# EAGLE design led_analog_watch_mvmt_v1_1 (EAGLE 5.11)
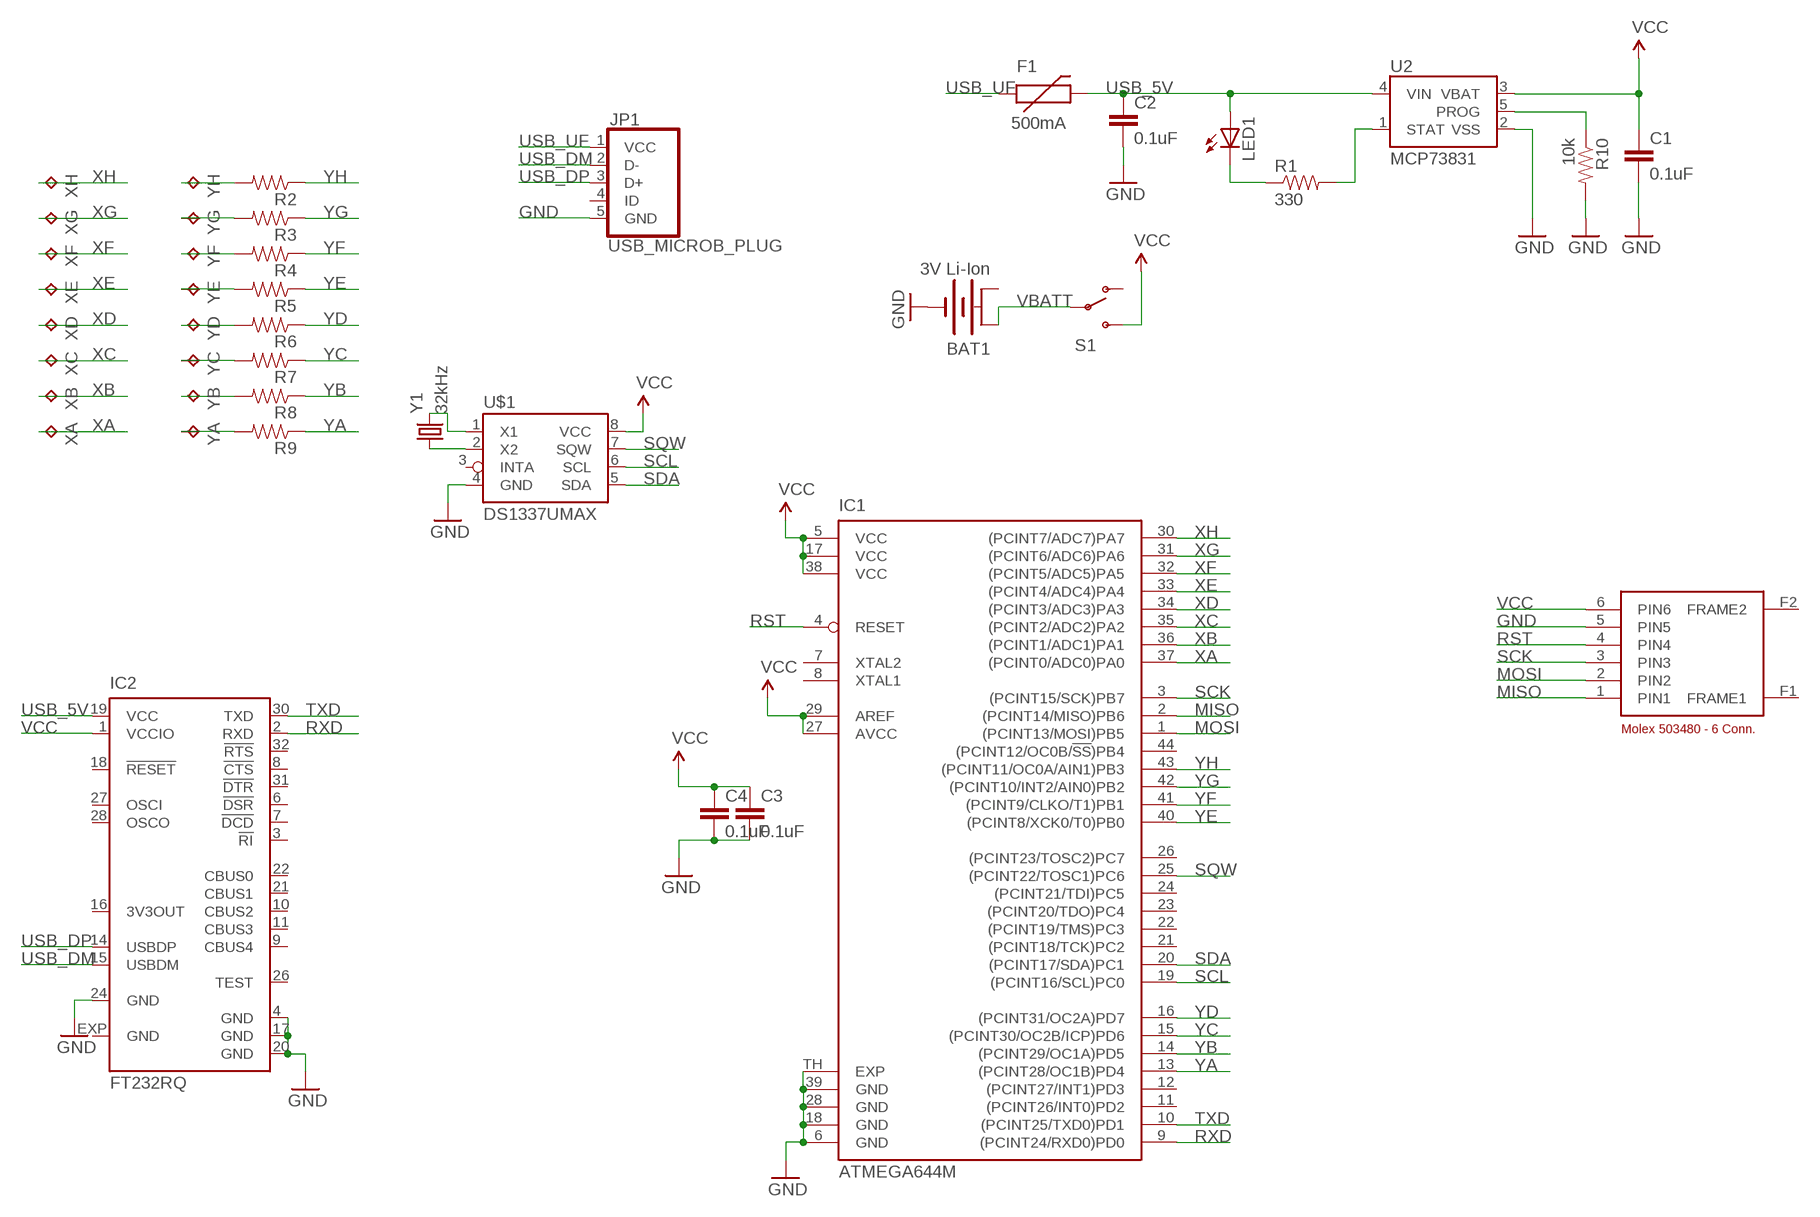
[diagram p0: schematic, sheet 1]

## Parts
BAT1  3V Li-Ion  BATTERY245PTH  [BATTCON_245MM_PTH]
C1  0.1uF  CAP-0603  [0603-CAP]
C2  0.1uF  CAP-0603  [0603-CAP]
C3  0.1uF  CAP-0603  [0603-CAP]
C4  0.1uF  CAP-0603  [0603-CAP]
F1  500mA  PTC0603  [0603]
IC1  ATMEGA644M  [MLF44-TH]
IC2  FT232RQ  [QFN32]
JP1  USB_MICROB_PLUG  [USB_MICRO_B_TYCO]
LED1  LED-0402  [0402]
R1  330  RESISTOR-0603  [0603]
R2  RESISTOR-0603  [0603]
R3  RESISTOR-0603  [0603]
R4  RESISTOR-0603  [0603]
R5  RESISTOR-0603  [0603]
R6  RESISTOR-0603  [0603]
R7  RESISTOR-0603  [0603]
R8  RESISTOR-0603  [0603]
R9  RESISTOR-0603  [0603]
R10  10k  RESISTOR-0603  [0603]
S1  SWITCH-SPSTMA12R  [SWITCH-MA12R]
U2  MCP73831  [SOT23-5]
U$1  DS1337UMAX  [UMAX8]
U$2  MOLEX_503480  [MOLEX_503480]
XA  TPTP20R  [TP20R]
XB  TPTP20R  [TP20R]
XC  TPTP20R  [TP20R]
XD  TPTP20R  [TP20R]
XE  TPTP20R  [TP20R]
XF  TPTP20R  [TP20R]
XG  TPTP20R  [TP20R]
XH  TPTP20R  [TP20R]
Y1  32kHz  CRYSTALABS10  [CRYSTAL-ABS10-SMD]
YA  TPTP20R  [TP20R]
YB  TPTP20R  [TP20R]
YC  TPTP20R  [TP20R]
YD  TPTP20R  [TP20R]
YE  TPTP20R  [TP20R]
YF  TPTP20R  [TP20R]
YG  TPTP20R  [TP20R]
YH  TPTP20R  [TP20R]

## Nets
GND: BAT1.2(-) C1.2 C2.2 C3.2 C4.2 IC1.6(GND) IC1.18(GND) IC1.28(GND) IC1.39(GND) IC1.TH(EXP) IC2.4(GND) IC2.17(GND) IC2.20(GND) IC2.24(GND) JP1.5(GND) R10.2 U2.2(VSS) U$1.4(GND) U$2.5(PIN5)
MISO: IC1.2((PCINT14/MISO)PB6) U$2.1(PIN1)
MOSI: IC1.1((PCINT13/MOSI)PB5) U$2.2(PIN2)
N$1: R1.2 U2.1(STAT)
N$2: R10.1 U2.5(PROG)
N$3: R2.2 YH.TP
N$4: R3.2 YG.TP
N$5: R4.2 YF.TP
N$6: R5.2 YE.TP
N$7: R6.2 YD.TP
N$8: R7.2 YC.TP
N$9: R8.2 YB.TP
N$10: R9.2 YA.TP
N$11: LED1.2(C) R1.1
N$14: U$1.2(X2) Y1.X1
N$15: U$1.1(X1) Y1.X2
RST: IC1.4(RESET) U$2.4(PIN4)
RXD: IC1.9((PCINT24/RXD0)PD0) IC2.2(RXD)
SCK: IC1.3((PCINT15/SCK)PB7) U$2.3(PIN3)
SCL: IC1.19((PCINT16/SCL)PC0) U$1.6(SCL)
SDA: IC1.20((PCINT17/SDA)PC1) U$1.5(SDA)
SQW: IC1.25((PCINT22/TOSC1)PC6) U$1.7(SQW)
TXD: IC1.10((PCINT25/TXD0)PD1) IC2.30(TXD)
USB_5V: C2.1 F1.2 IC2.19(VCC) LED1.1(A) U2.4(VIN)
USB_DM: IC2.15(USBDM) JP1.2(D-)
USB_DP: IC2.14(USBDP) JP1.3(D+)
USB_UF: F1.1 JP1.1(VCC)
VBATT [supply]: BAT1.3(+A) S1.2(P)
VCC: C1.1 C3.1 C4.1 IC1.5(VCC) IC1.17(VCC) IC1.27(AVCC) IC1.29(AREF) IC1.38(VCC) IC2.1(VCCIO) S1.3(S) U2.3(VBAT) U$1.8(VCC) U$2.6(PIN6)
XA: IC1.37((PCINT0/ADC0)PA0) XA.TP
XB: IC1.36((PCINT1/ADC1)PA1) XB.TP
XC: IC1.35((PCINT2/ADC2)PA2) XC.TP
XD: IC1.34((PCINT3/ADC3)PA3) XD.TP
XE: IC1.33((PCINT4/ADC4)PA4) XE.TP
XF: IC1.32((PCINT5/ADC5)PA5) XF.TP
XG: IC1.31((PCINT6/ADC6)PA6) XG.TP
XH: IC1.30((PCINT7/ADC7)PA7) XH.TP
YA: IC1.13((PCINT28/OC1B)PD4) R9.1
YB: IC1.14((PCINT29/OC1A)PD5) R8.1
YC: IC1.15((PCINT30/OC2B/ICP)PD6) R7.1
YD: IC1.16((PCINT31/OC2A)PD7) R6.1
YE: IC1.40((PCINT8/XCK0/T0)PB0) R5.1
YF: IC1.41((PCINT9/CLKO/T1)PB1) R4.1
YG: IC1.42((PCINT10/INT2/AIN0)PB2) R3.1
YH: IC1.43((PCINT11/OC0A/AIN1)PB3) R2.1
Unconnected: IC1.7(XTAL2) IC1.8(XTAL1) IC1.11((PCINT26/INT0)PD2) IC1.12((PCINT27/INT1)PD3) IC1.21((PCINT18/TCK)PC2) IC1.22((PCINT19/TMS)PC3) IC1.23((PCINT20/TDO)PC4) IC1.24((PCINT21/TDI)PC5) IC1.26((PCINT23/TOSC2)PC7) IC1.44((PCINT12/OC0B/!SS!)PB4) IC2.3(!RI) IC2.6(!DSR) IC2.7(!DCD) IC2.8(!CTS) IC2.9(CBUS4) IC2.10(CBUS2) IC2.11(CBUS3) IC2.16(3V3OUT) IC2.18(!RESET) IC2.21(CBUS1) IC2.22(CBUS0) IC2.26(TEST) IC2.27(OSCI) IC2.28(OSCO) IC2.31(!DTR) IC2.32(!RTS) JP1.4(ID) S1.1(O) U$1.3(INTA) U$2.F1(FRAME1) U$2.F2(FRAME2)

## Power pins joined to a net without a drawn wire
+B: BAT1.1(+B)
GND: IC2.EXP(GND)

## Library data of the parts
BAT1 = jcole:BATTERY: Battery Holders Various common sizes : AA, AAA, 20mm coin cell and 12mm coin cell.
C1-C4 = jcole:CAP: Capacitor Standard 0603 ceramic capacitor, and 0.1" leaded capacitor.
F1 = SparkFun:PTC: Resettable Fuse PTC Resettable Fuse. Spark Fun Electronics SKU : COM-08357
IC1 = atmel:ATMEGA644*: 8-bit Microcontroller with 64K Bytes In-System Programmable Flash Source: http://www.atmel.com/dyn/resources/prod_documents/doc2593.pdf; MPN: ATMEGA644P-20MU; OC_FARNELL: 1748528; OC_NEWARK: 26R5636
IC2 = jcole:FT232R: Source: http://www.ftdichip.com/Documents/DataSheets/DS_FT232R_v104.pdf; MPN: FT232RQ; OC_FARNELL: 1146033; OC_NEWARK: 91K9919
JP1 = jcole:USB_MICROB_PLUG: USB Micro-B Plug Comes in a variety of packages. Check out Hirose's ZX-x0 line: http://www.hirose.co.jp/cataloge_hp/e24200011.pdf
LED1 = jcole:LED: LEDs Standard schematic elements and footprints for 5mm, 3mm, 1206, and 0603 sized LEDs. 5mm - Spark Fun Electronics SKU : COM-00529 (and others)
R1-R10 = jcole:RESISTOR: Resistor Basic schematic elements and footprints for 0603, 1206, and PTH resistors.
S1 = jcole:SWITCH-SPST: SPST Switch Simple slide switch. Spark Fun Electronics SKU : COM-00102
U2 = SparkFun:MCP73831: Microchip's MCP73831 Miniature single cell, fully integrated Li-Ion, Li-polymer charge management controller http://ww1.microchip.com/downloads/en/DeviceDoc/21984a.pdf
U$1 = jcole:DS1337
U$2 = jcole:MOLEX_503480
XA XB XC XD XE XF XG XH YA YB YC YD YE YF YG YH = testpad:TP: Test pad
Y1 = jcole:CRYSTAL: Crystals Various standard crystals. Proven footprints. Spark Fun Electronics SKU : COM-00534

## Net classes
0 signal: width 0.203 mm
1 supply: width 0.305 mm

## Board
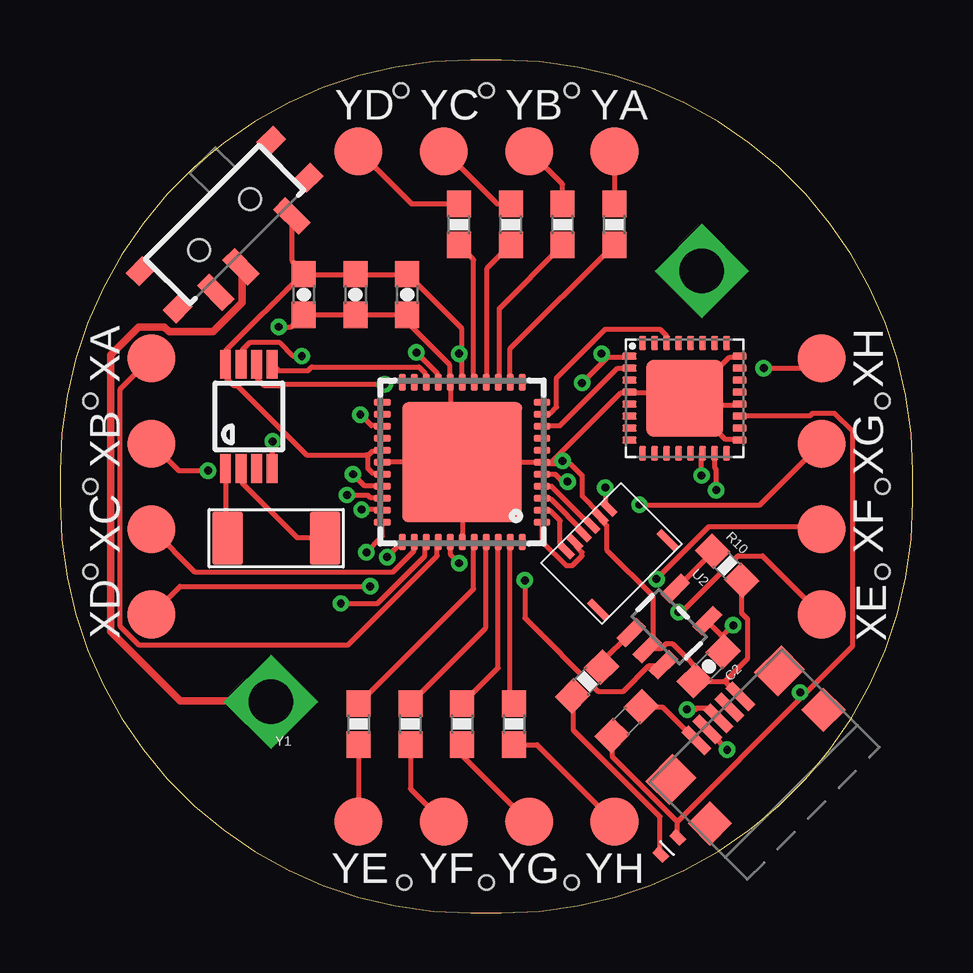
[diagram p1: board, top side]
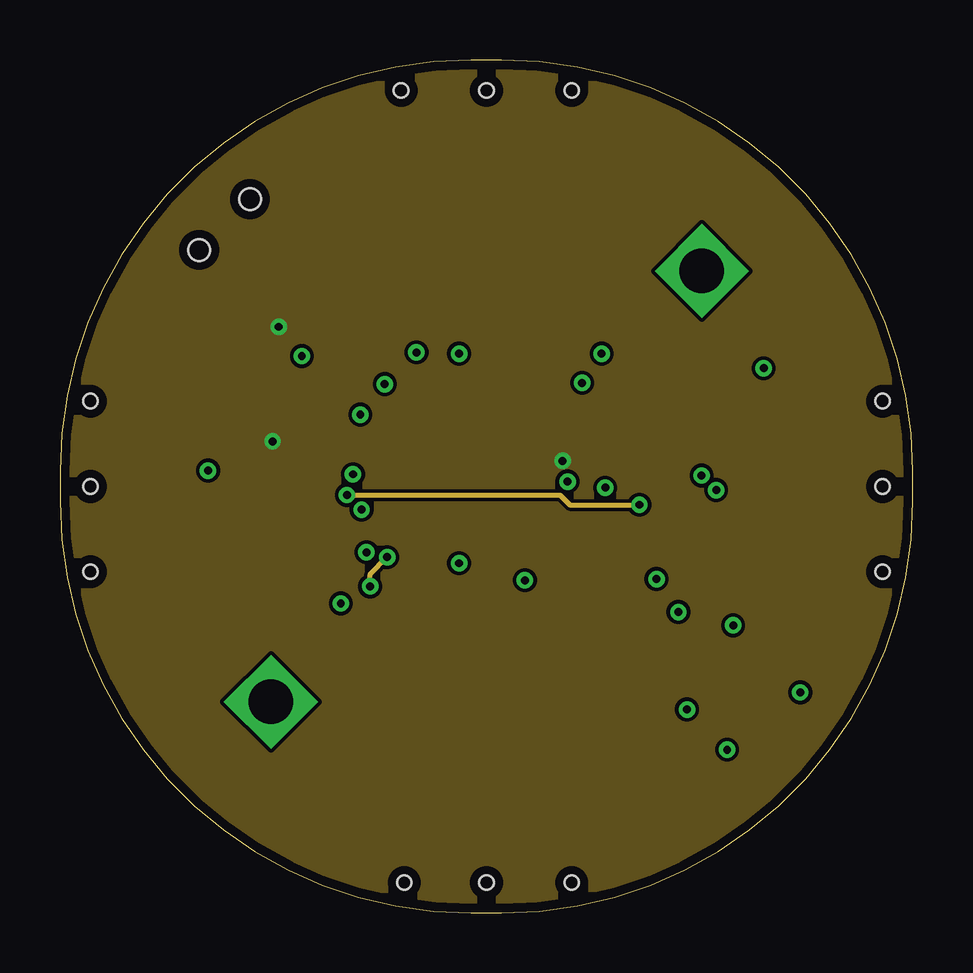
[diagram p2: board, inner layer GND]
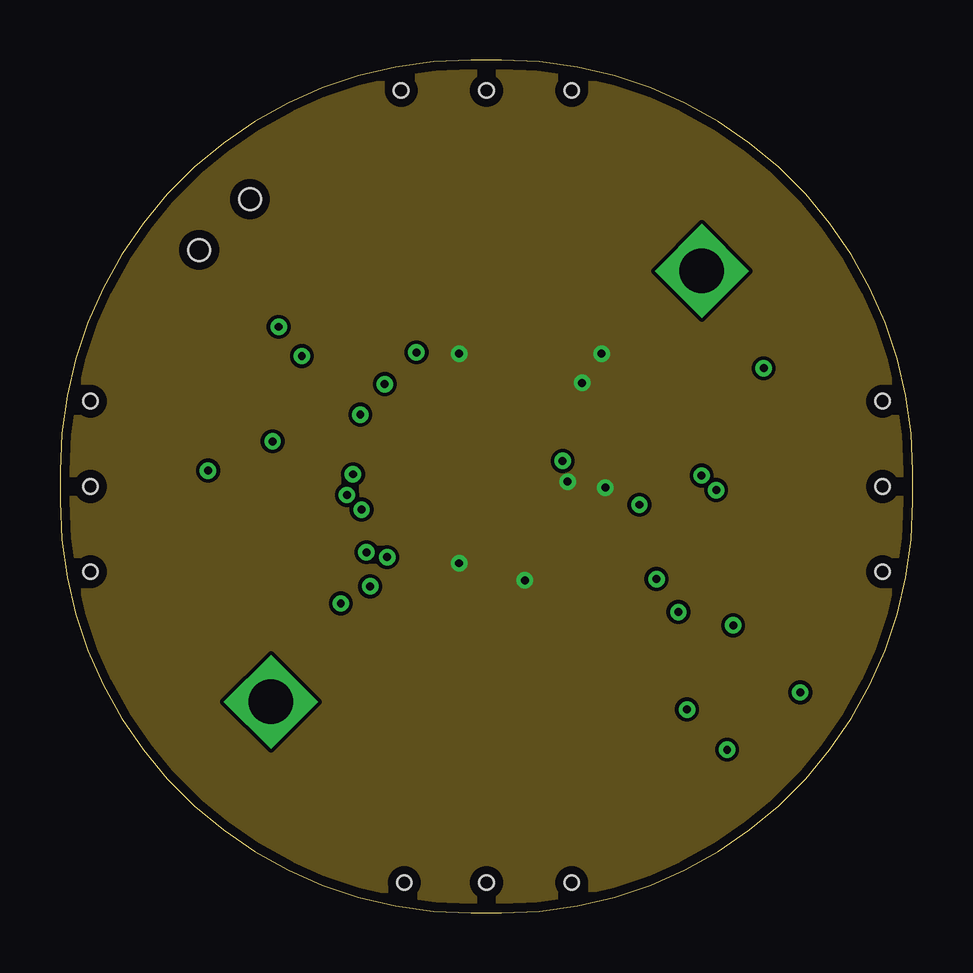
[diagram p3: board, inner layer VCC]
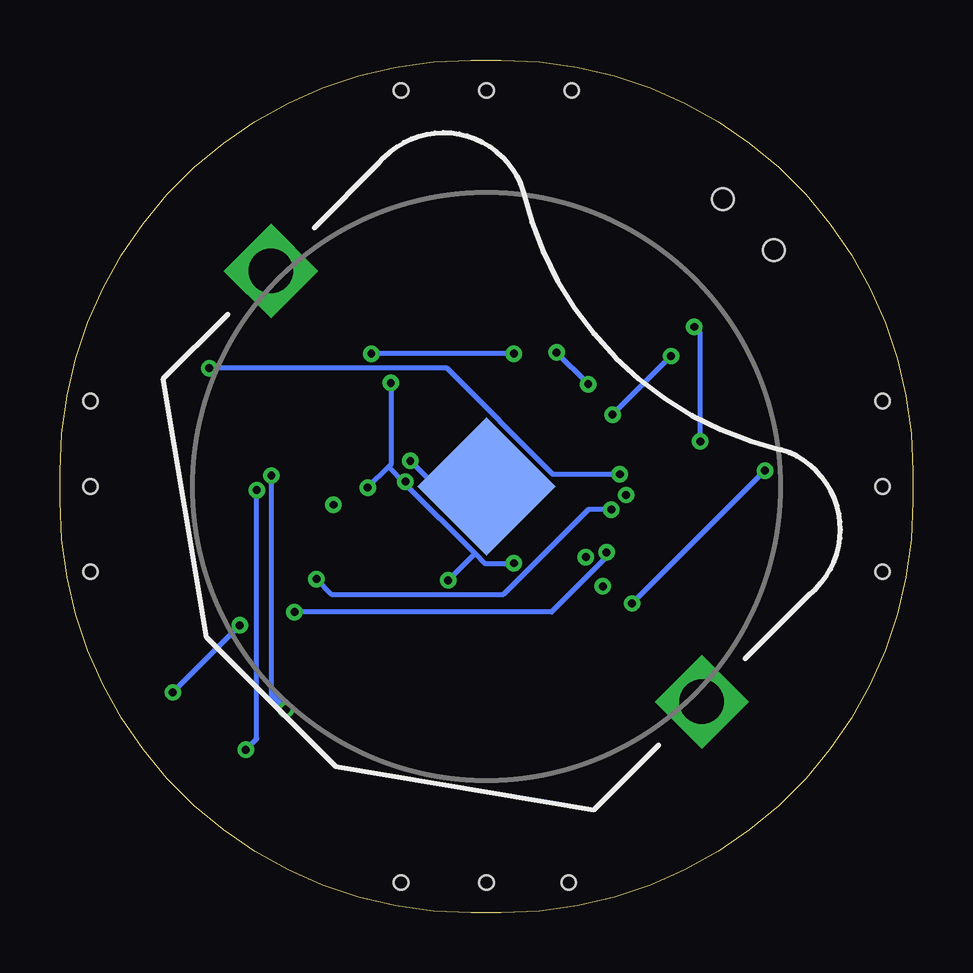
[diagram p4: board, bottom side, seen from below]

Size 35.56 x 35.56 mm. Coordinates in mm from the lower left corner, seen from the top.
Outline: 18.42,0 arc90 35.56,17.14 35.56,18.41 arc90 18.42,35.56 17.14,35.56 arc90 0,18.41 0,17.14 arc90 17.14,0 18.42,0
Copper layers (1*2+15*16): Top 0.0356mm / dielectric 1.5011mm / GND 0.0356mm / dielectric 0.1499mm / VCC 0.0356mm / dielectric 0.2007mm / Bottom 0.0356mm
Design rules "LaenPCBOrder *": minimum track width 6mil, minimum drill 13mil, track to track 6mil, track to pad 6mil, pad to pad 6mil, via to via 6mil, smd to smd 6mil, copper to edge 15mil, drill to drill 6mil, minimum pad ring 7mil, minimum via ring 7mil, stop-mask expansion 4mil, vias tented up to drill 0mil, thermal gap 10mil
Holes 0.6 mm at 17.78,1.27 34.29,17.78 1.27,17.78 17.78,34.29 34.29,14.22 34.29,21.34 21.34,1.27 14.35,1.27 1.27,14.22 1.27,21.34 14.22,34.29 21.34,34.29
vRestrict: area 7.7,14.5 to 10.3,16.8

### Footprints (pad centres in the part's own frame; a part is rotated, then mirrored left to right if it is on the bottom)
BATTCON_245MM_PTH = drill 1.854 square: 1 -12.7,0; 3 12.7,0 | smd 4.064 x 4.064: 2 0,0
0603-CAP = smd 1.1 x 1: 1 -0.85,0; 2 0.85,0
0603 = smd 1.1 x 1: 1 -0.85,0; 2 0.85,0
MLF44-TH = smd 0.7 x 0.3: 1 -3.325,2.5; 2 -3.325,2; 3 -3.325,1.5; 4 -3.325,1; 5 -3.325,0.5; 6 -3.325,0; 7 -3.325,-0.5; 8 -3.325,-1; 9 -3.325,-1.5; 10 -3.325,-2; 11 -3.325,-2.5; 23 3.325,-2.5; 24 3.325,-2; 25 3.325,-1.5; 26 3.325,-1; 27 3.325,-0.5; 28 3.325,0; 29 3.325,0.5; 30 3.325,1; 31 3.325,1.5; 32 3.325,2; 33 3.325,2.5 | smd 0.3 x 0.7: 12 -2.5,-3.325; 13 -2,-3.325; 14 -1.5,-3.325; 15 -1,-3.325; 16 -0.5,-3.325; 17 0,-3.325; 18 0.5,-3.325; 19 1,-3.325; 20 1.5,-3.325; 21 2,-3.325; 22 2.5,-3.325; 34 2.5,3.325; 35 2,3.325; 36 1.5,3.325; 37 1,3.325; 38 0.5,3.325; 39 0,3.325; 40 -0.5,3.325; 41 -1,3.325; 42 -1.5,3.325; 43 -2,3.325; 44 -2.5,3.325 | smd 5 x 5: TH 0,0
QFN32 = smd 0.6 x 0.3: 1 -2.3,1.75; 2 -2.3,1.25; 3 -2.3,0.75; 4 -2.3,0.25; 5 -2.3,-0.25; 6 -2.3,-0.75; 7 -2.3,-1.25; 8 -2.3,-1.75; 17 2.3,-1.75; 18 2.3,-1.25; 19 2.3,-0.75; 20 2.3,-0.25; 21 2.3,0.25; 22 2.3,0.75; 23 2.3,1.25; 24 2.3,1.75 | smd 0.3 x 0.6: 9 -1.75,-2.3; 10 -1.25,-2.3; 11 -0.75,-2.3; 12 -0.25,-2.3; 13 0.25,-2.3; 14 0.75,-2.3; 15 1.25,-2.3; 16 1.75,-2.3; 25 1.75,2.3; 26 1.25,2.3; 27 0.75,2.3; 28 0.25,2.3; 29 -0.25,2.3; 30 -0.75,2.3; 31 -1.25,2.3; 32 -1.75,2.3 | smd 3.2 x 3.2: EXP 0,0
USB_MICRO_B_TYCO = smd 0.4 x 1.35: 1 -1.3,2.85; 2 -0.65,2.85; 3 0,2.85; 4 0.65,2.85; 5 1.3,2.85 | smd 1.3 x 1.3: SH@1 3.35,0; SH@2 -3.35,0 | smd 1.6 x 1.4: SH@3 3.2,2.45; SH@4 -3.2,2.45
0402 = smd 0.6 x 0.4: 1 0,-0.5; 2 0,0.5
SWITCH-MA12R = smd 0.711 x 1.499: 1 -2.261,-1.74; 2 -0.762,-1.74; 3 2.235,-1.74 | smd 0.991 x 0.787: 4 3.848,-1.092; 5 -3.848,-1.092; 6 -3.848,1.092; 7 3.848,1.092 | hole 0.9: -1.499,0; 1.499,0
SOT23-5 = smd 0.55 x 1.2: 1 -0.95,-1.3; 2 0,-1.3; 3 0.95,-1.3; 4 0.95,1.3; 5 -0.95,1.3
UMAX8 = smd 0.45 x 1.2: 1 -0.975,-2.175; 2 -0.325,-2.175; 3 0.325,-2.175; 4 0.975,-2.175; 5 0.975,2.175; 6 0.325,2.175; 7 -0.325,2.175; 8 -0.975,2.175
MOLEX_503480 = smd 0.3 x 0.7: 1 -1.25,1.4; 2 -0.75,1.4; 3 -0.25,1.4; 4 0.25,1.4; 5 0.75,1.4; 6 1.25,1.4 | smd 0.3 x 1: F1 -2.05,-1.25; F2 2.05,-1.25
TP20R = smd 2 x 2: TP 0,0
CRYSTAL-ABS10-SMD = smd 1.27 x 2.21: X1 -2.032,0; X2 2.032,0

### Placement (x,y rotation side)
BAT1  17.78,17.78 315 bottom
C1  14.48,25.78 270 top
C2  27.05,10.29 225 top
C3  10.16,25.78 270 top
C4  12.32,25.78 270 top
F1  23.62,8 225 top
IC1  16.76,18.8 180 top
IC2  26.04,21.46 0 top
JP1  29.46,6.1 45 top
LED1  25.4,2.79 135 top
R1  21.97,9.65 45 top
R2  18.92,7.87 270 top
R3  16.76,7.87 270 top
R4  14.6,7.87 270 top
R5  12.45,7.87 270 top
R6  16.64,28.7 90 top
R7  18.8,28.7 90 top
R8  20.96,28.7 90 top
R9  23.11,28.7 90 top
R10  27.81,14.48 315 top
S1  6.86,28.7 45 top
U2  25.4,11.94 315 top
U$1  7.87,20.7 0 top
U$2  22.99,14.99 45 top
XA  3.81,23.11 0 top
XB  3.81,19.56 0 top
XC  3.81,16 0 top
XD  3.81,12.45 0 top
XE  31.75,12.45 0 top
XF  31.75,16 0 top
XG  31.75,19.56 0 top
XH  31.75,23.11 0 top
Y1  9.02,15.62 180 top
YA  23.11,31.75 270 top
YB  19.56,31.75 270 top
YC  16,31.75 270 top
YD  12.45,31.75 270 top
YE  12.45,3.81 270 top
YF  16,3.81 270 top
YG  19.56,3.81 270 top
YH  23.11,3.81 270 top

### Tracks (layer width: path | path; a pad name or v marks a point on that pad's centre or on a via)
GND  (via drill 0.33)
  Top 0.203: v8.87,19.66 8.87,18.54 U$1.4 | v9.12,24.43 9.63,24.43 10.08,24.89 C3.2 10.18,24.94 12.32,24.94 C4.2 12.37,24.94 14.45,24.94 C1.2 14.5,24.84 14.5,24.59 16.23,22.86 16.23,22.2 IC1.18 16.28,22.1 16.28,18.85 IC1.TH | 27.71,9.65 26.49,9.65 C2.2 27.05,9.7 25.53,11.23 25.27,11.23 25.07,11.02 24.51,11.02 U2.2 24.71,11.07 24.71,13.21 22.78,15.14 22.78,16.15 22.53,16.41 U$2.5 22.48,16.51 22.48,16.66 21.77,17.37 21.77,18.24 21.26,18.75 20.96,18.75 | 27.71,9.65 28.32,9.04 JP1.5 | R10.2 28.42,13.87 28.42,12.5 28.68,12.24 28.68,10.62 27.71,9.65 | IC2.EXP 26.04,21.49 25.83,21.69 23.75,21.69 IC2.4 23.65,21.69 23.39,21.69 20.5,18.8 20.5,18.75 | IC2.17 28.32,19.76 27.71,19.76 26.09,21.39 IC2.EXP | IC2.20 28.32,21.18 26.39,21.18 IC2.EXP | IC2.24 28.32,23.16 27.92,23.16 26.19,21.44 IC2.EXP | IC1.TH IC1.28 | IC1.39 16.79,15.49 16.79,18.75 IC1.TH | IC1.TH IC1.6 20.14,18.75 20.5,18.75 | 20.5,18.75 20.96,18.75 | 20.96,18.75 v20.96,18.85
  Bottom 0.203: v8.87,19.66 8.87,24.18 v9.12,24.43 | v20.96,18.85 19.89,17.78 BAT1.2
  pour GND: -0.13,0 35.43,0 35.43,35.56 -0.13,35.56
MISO
  Top 0.203: IC1.2 20.09,16.76 20.45,16.76 20.85,16.36 20.85,15.39 21.11,15.14 U$2.1
MOSI
  Top 0.203: U$2.2 21.51,15.44 21.51,15.29 21.77,15.04 21.77,14.88 21.36,14.48 21.11,14.48 20.09,15.49 20.09,16.26 IC1.1
N$1
  Top 0.203: R1.2 22.58,10.26 22.58,10.46 23.8,11.68 U2.1
N$2
  Top 0.203: R10.1 27.2,15.04 25.68,13.51 U2.5
N$3
  Top 0.203: R2.2 19.89,7.01 23.09,3.81 YH.TP
N$4
  Top 0.203: R3.2 16.79,7.01 16.79,6.55 19.53,3.81 YG.TP
N$5
  Top 0.203: R4.2 14.6,5.18 15.98,3.81 YF.TP
N$6
  Top 0.203: R5.2 12.47,7.01 12.47,3.81 YE.TP
N$7
  Top 0.203: R6.2 16.64,29.57 14.66,29.57 12.47,31.75 YD.TP
N$8
  Top 0.203: R7.2 18.77,29.57 18.21,29.57 16.03,31.75 YC.TP
N$9
  Top 0.203: R8.2 20.96,30.38 19.58,31.75 YB.TP
N$10
  Top 0.203: R9.2 23.14,29.57 23.14,31.75 YA.TP
N$11
  Top 0.203: LED1.2 25.02,2.49 25.02,4.01 21.41,7.62 21.41,9.04 R1.1
N$14
  Top 0.203: U$1.2 7.6,18.49 7.6,17.93 9.88,15.65 11.05,15.65 Y1.X1
N$15
  Top 0.203: U$1.1 6.93,18.49 6.93,15.7 6.99,15.65 Y1.X2
RST
  Top 0.203: U$2.4 22.12,16.15 20.5,17.78 20.09,17.78 IC1.4
RXD
  Top 0.203: IC2.2 23.7,22.71 23.24,22.71 20.85,20.32 20.09,20.32 IC1.9
SCK
  Top 0.203: IC1.3 20.09,17.27 20.45,17.27 21.87,15.85 U$2.3
SCL  (via drill 0.33)
  Top 0.203: v14.86,23.37 15.72,22.5 15.72,22.15 IC1.19 | v13.54,22.05 9.22,22.05 9.17,22 8.51,22 8.2,22.3 8.2,22.86 U$1.6
  Bottom 0.203: v13.54,22.05 v14.86,23.37
SDA
  Top 0.203: IC1.20 15.21,22.15 15.21,22.5 14.96,22.76 10.49,22.76 10.34,22.61 9.12,22.61 8.87,22.86 U$1.5
SQW  (via drill 0.33)
  Top 0.203: v12.52,20.78 12.98,20.32 13.44,20.32 IC1.25 | v10.08,23.22 9.73,23.22 9.17,23.77 7.9,23.77 7.6,23.47 7.6,22.91 U$1.7
  Bottom 0.203: v12.52,20.78 v10.08,23.22
TXD
  Top 0.203: IC2.30 25.27,23.77 25.27,24.08 25.02,24.33 22.73,24.33 20.7,22.3 20.7,21.08 20.45,20.83 20.09,20.83 IC1.10
USB_5V  (via drill 0.33)
  Top 0.203: U2.4 27,12.14 27.61,11.53 27.61,10.92 C2.1 27.66,11.58 v28.07,11.99 | 25.73,3.81 25.73,3.15 LED1.1 | 25.73,3.81 23.04,6.5 23.04,7.37 F1.2 | 30.99,9.07 33.04,11.12 33.04,20.07 32.28,20.83 31.37,20.83 31.27,20.73 28.37,20.73 IC2.19 | 25.73,3.81 30.99,9.07 | 30.99,9.07 v30.86,9.2
  Bottom 0.203: v30.86,9.2 v28.07,11.99
USB_DM  (via drill 0.33)
  Top 0.203: v27.36,17.63 27.36,18.49 27.3,18.54 27.3,19.15 IC2.15 | v27.81,6.81 27,7.62 JP1.2
  Bottom 0.203: v27.36,17.63 27.36,7.26 v27.81,6.81
USB_DP  (via drill 0.33)
  Top 0.203: v26.75,18.24 26.75,19.15 IC2.14 | v26.14,8.48 26.49,8.48 26.54,8.53 27,8.53 27.41,8.13 JP1.3
  Bottom 0.203: v26.75,18.24 26.75,9.09 v26.14,8.48
USB_UF
  Top 0.203: F1.1 24.26,8.59 25.12,8.59 26.49,7.21 JP1.1
VBATT
  Top 0.305: S1.2 7.6,26.92 7.6,25.45 6.38,24.23 4.55,24.23 4.34,24.43 3.28,24.43 2.11,23.27 2.11,11.73 5,8.84 8.76,8.84 BAT1.3
VCC  (via drill 0.33)
  Top 0.203: 12.83,19.05 12.83,18.54 13.03,18.34 13.44,18.34 IC1.29 | 12.83,19.05 13.03,19.25 13.44,19.25 IC1.27 | 12.83,19.05 12.78,19.1 10.29,19.1 7.39,22 7.24,22 6.93,22.3 6.93,22.86 U$1.8 6.93,22.96 6.93,23.47 10.08,26.62 C3.1 | C3.1 10.18,26.62 12.32,26.62 C4.1 12.37,26.62 14.4,26.62 C1.1 14.5,26.62 16.74,24.38 16.74,23.32 | S1.3 9.68,29.01 9.68,27.18 10.13,26.72 C3.1 | 16.74,23.32 16.74,22.15 IC1.17 | 22.78,23.11 v21.77,22.1 | 22.78,23.11 22.84,23.16 23.7,23.16 IC2.1 | v22.73,17.73 22.73,16.97 22.84,16.87 U$2.6 | v16.64,14.58 16.28,14.94 16.28,15.44 IC1.38 | v21.16,17.98 20.96,17.98 20.65,18.29 20.09,18.29 IC1.5 | v19.38,13.87 19.38,12.29 22.43,9.25 23.5,9.25 24.56,10.31 25.12,10.31 U2.3 | 16.74,23.32 v16.64,23.32 | v22.58,23.32 22.78,23.11
  Bottom 0.203: v21.77,22.1 21.77,18.69 21.87,18.59 | 21.87,18.59 v22.73,17.73 | v16.64,14.58 17.86,14.58 18.26,14.99 | 21.21,17.93 18.26,14.99 | 21.87,18.59 21.21,17.93 | 21.21,17.93 v21.16,17.98 | 18.26,14.99 v19.38,13.87 | v16.64,23.32 v22.58,23.32
  pour VCC: -0.13,0 35.43,0 35.43,35.56 -0.13,35.56
XA
  Top 0.203: IC1.37 15.72,15.44 15.72,14.88 12.01,11.18 3.28,11.18 2.51,11.94 2.51,21.84 3.79,23.11 XA.TP
XB  (via drill 0.33)
  Top 0.203: v11.71,12.9 13.23,12.9 15.21,14.88 15.21,15.44 IC1.36 | v6.17,18.44 4.95,18.44 3.83,19.56 XB.TP
  Bottom 0.203: v6.17,18.44 v11.71,12.9
XC
  Top 0.203: IC1.35 14.76,15.44 14.76,15.09 13.89,14.22 5.61,14.22 3.83,16 XC.TP
XD  (via drill 0.33)
  Top 0.203: v13.64,14.83 14.25,15.44 IC1.34 | v12.93,13.61 5,13.61 3.83,12.45 XD.TP
  GND 0.203: v13.64,14.83 12.93,14.12 v12.93,13.61
XE  (via drill 0.33)
  Top 0.203: v12.78,15.04 13.44,15.7 13.44,16.26 IC1.33 | v25.78,12.55 25.93,12.55 28.27,14.88 29.29,14.88 31.73,12.45 XE.TP
  Bottom 0.203: v12.78,15.04 12.78,14.83 15.06,12.55 v25.78,12.55
XF  (via drill 0.33)
  Top 0.203: v12.57,16.82 13.44,16.82 IC1.32 | v24.87,13.92 27.05,16.1 31.62,16.1 31.73,16 XF.TP
  Bottom 0.203: v12.57,16.82 13.54,16.82 17.09,13.26 24.21,13.26 v24.87,13.92
XG  (via drill 0.33)
  Top 0.203: v11.96,17.42 12.83,17.42 12.93,17.32 13.44,17.32 IC1.31 | v24.16,17.02 29.19,17.02 31.73,19.56 XG.TP
  GND 0.203: v11.96,17.42 20.85,17.42 21.26,17.02 v24.16,17.02
XH  (via drill 0.33)
  Top 0.203: v12.22,18.29 12.67,17.83 13.44,17.83 IC1.30 | v29.34,22.71 31.32,22.71 31.73,23.11 XH.TP
  Bottom 0.203: v12.22,18.29 15.01,18.29 19.43,22.71 v29.34,22.71
YA
  Top 0.203: IC1.13 18.77,22.15 18.77,23.52 23.09,27.84 R9.1
YB
  Top 0.203: IC1.14 18.31,22.15 18.31,25.2 20.96,27.84 R8.1
YC
  Top 0.203: IC1.15 17.8,22.15 17.8,26.87 18.77,27.84 R7.1
YD
  Top 0.203: IC1.16 17.25,22.15 17.25,27.23 16.64,27.84 R6.1
YE
  Top 0.203: IC1.40 17.25,15.44 17.25,13.51 12.47,8.74 R5.1
YF
  Top 0.203: IC1.41 17.76,15.44 17.76,11.89 14.6,8.74 R4.1
YG
  Top 0.203: IC1.42 18.26,15.44 18.26,10.21 16.79,8.74 R3.1
YH
  Top 0.203: IC1.43 18.77,15.44 18.77,8.89 18.92,8.74 R2.1